# EAGLE design SmartPiezo (EAGLE 6.1)
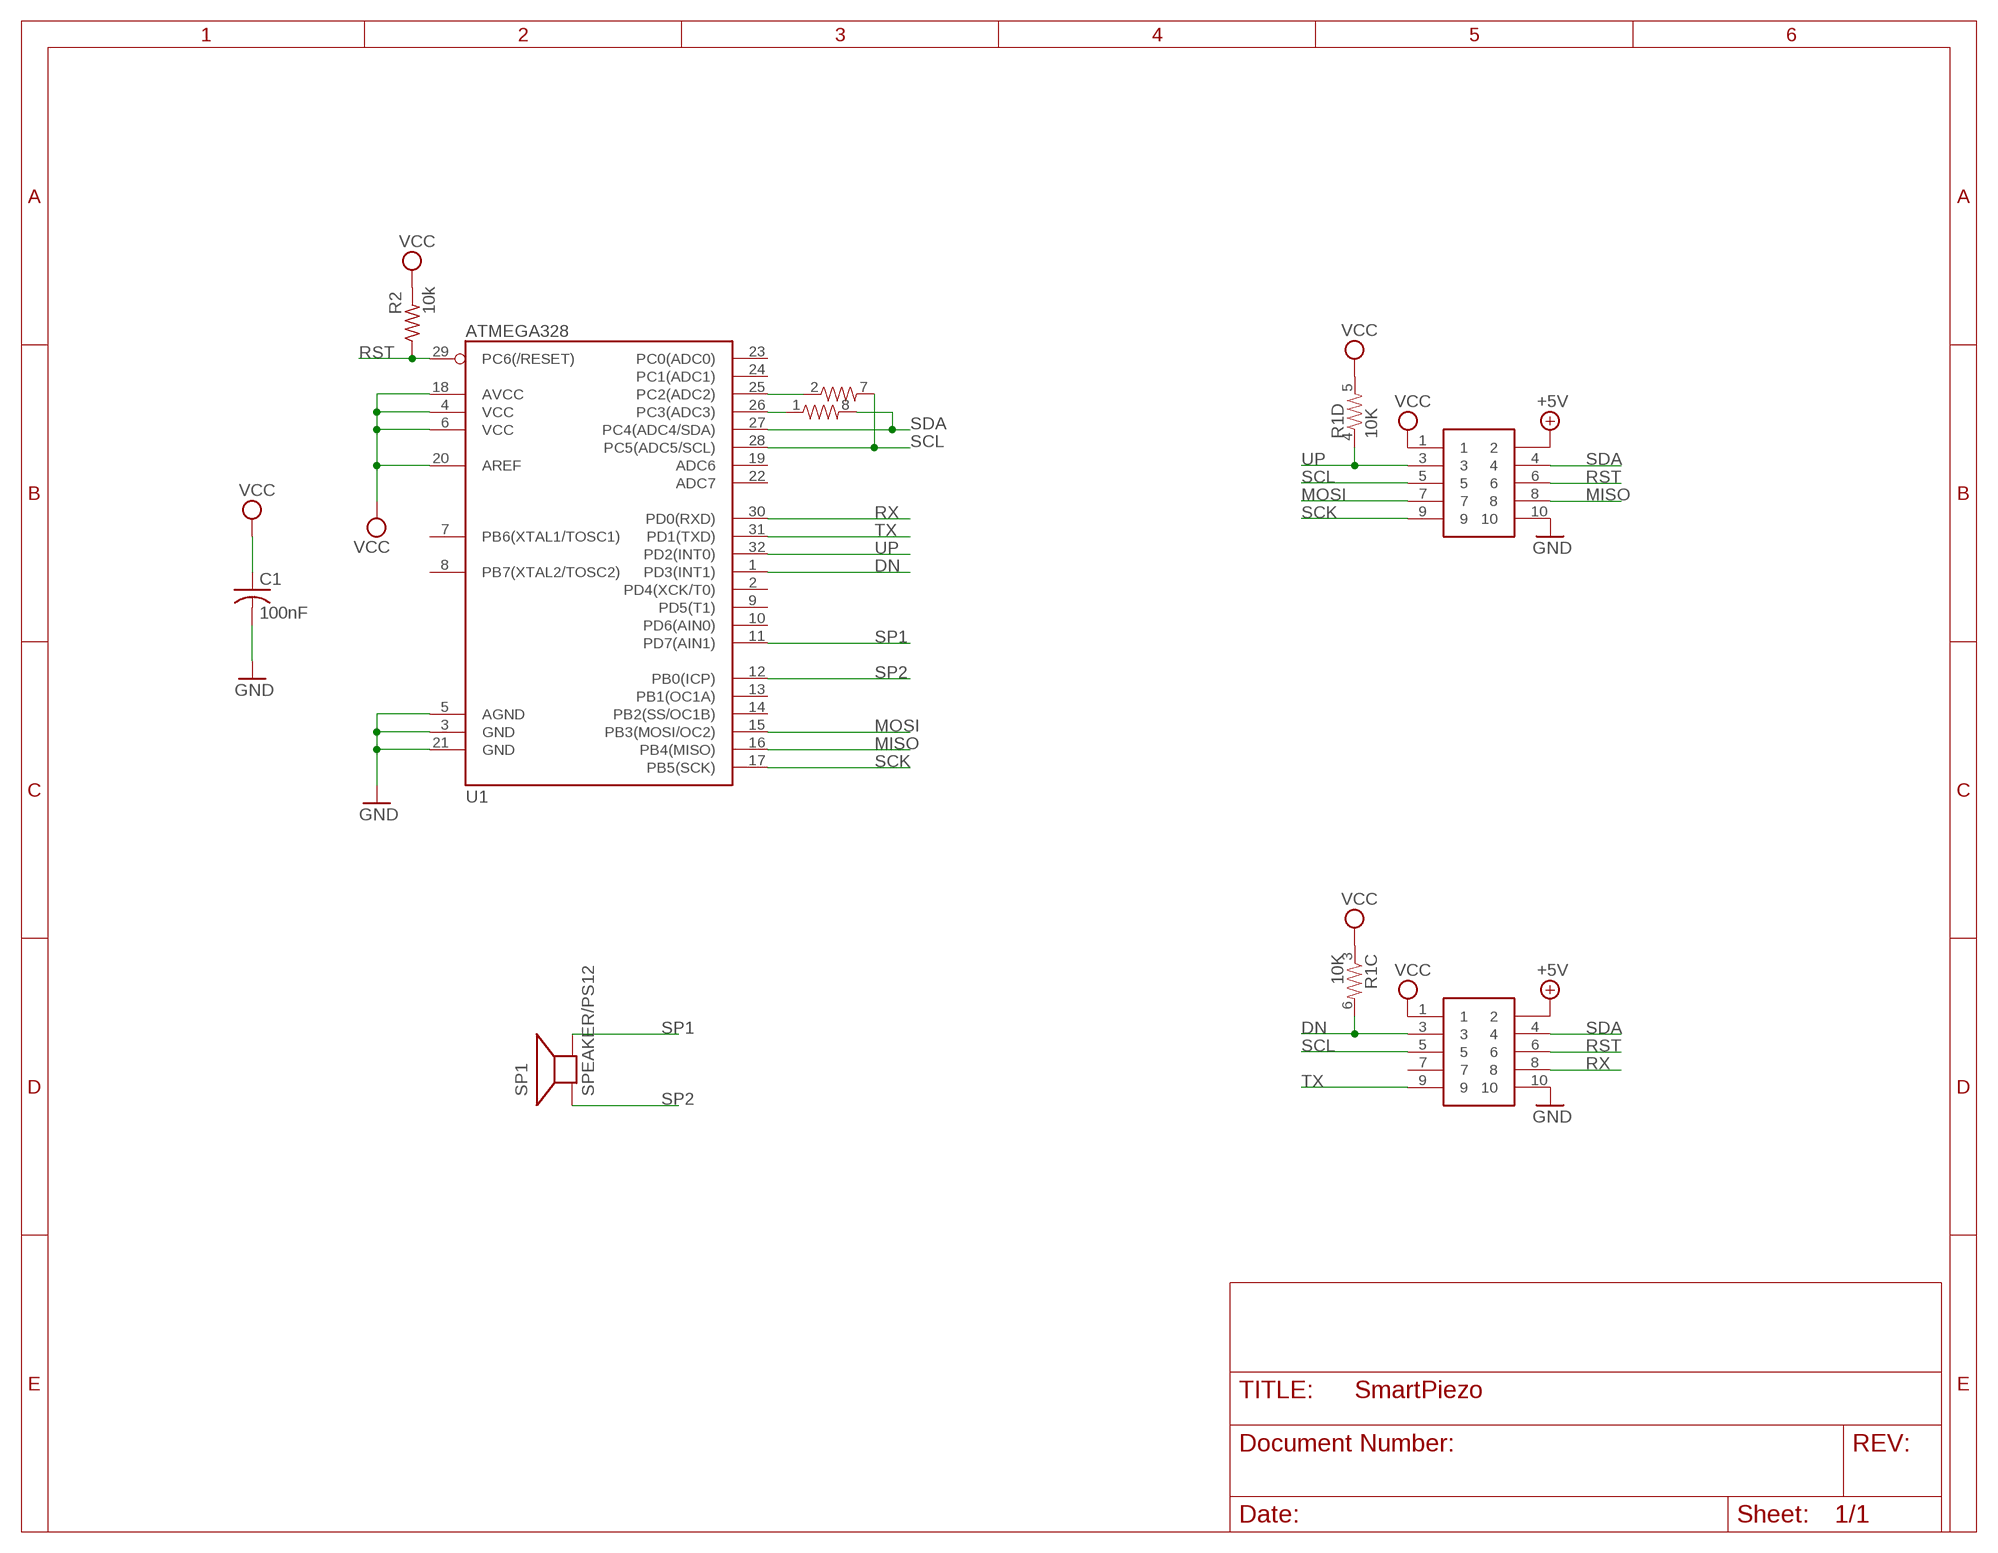
[diagram p0: schematic, sheet 1]

## Parts
*  SHF105SM  [SHF105DSM]
C1  100nF  C-USC0603K  [C0603K]
R1  10K  RESISTOR-ARRAY0603-ARV  [0603-ARV]
R2  10k  R-US_R0603  [R0603]
SP1  SPEAKER/PS12  [PS12]
U1  ATMEGA328  ATMEGA168  [TQFP32-08]
XY  SHF105SM  [SHF105DSM]

## Nets
+5V: *.2 XY.2
DN: *.3 R1.6 U1.1(PD3(INT1))
GND: *.10 C1.2 U1.3(GND) U1.5(AGND) U1.21(GND) XY.10
MISO: U1.16(PB4(MISO)) XY.8
MOSI: U1.15(PB3(MOSI/OC2)) XY.7
N$1: R1.2 U1.25(PC2(ADC2))
N$2: R1.1 U1.26(PC3(ADC3))
RST: *.6 R2.1 U1.29(PC6(/RESET)) XY.6
RX: *.8 U1.30(PD0(RXD))
SCK: U1.17(PB5(SCK)) XY.9
SCL: *.5 R1.7 U1.28(PC5(ADC5/SCL)) XY.5
SDA: *.4 R1.8 U1.27(PC4(ADC4/SDA)) XY.4
SP1: SP1.P$2(-) U1.11(PD7(AIN1))
SP2: SP1.P$1(+) U1.12(PB0(ICP))
TX: *.9 U1.31(PD1(TXD))
UP: R1.4 U1.32(PD2(INT0)) XY.3
VCC: *.1 C1.1 R1.3 R1.5 R2.2 U1.4(VCC) U1.6(VCC) U1.18(AVCC) U1.20(AREF) XY.1
Unconnected: *.7 U1.2(PD4(XCK/T0)) U1.7(PB6(XTAL1/TOSC1)) U1.8(PB7(XTAL2/TOSC2)) U1.9(PD5(T1)) U1.10(PD6(AIN0)) U1.13(PB1(OC1A)) U1.14(PB2(SS/OC1B)) U1.19(ADC6) U1.22(ADC7) U1.23(PC0(ADC0)) U1.24(PC1(ADC1))

## Notes on the sheet
- RST
- SDA
- SCL
- UP | SDA
- SCL | RST
- MOSI | MISO
- RX | SCK
- TX
- UP
- DN
- SP1
- SP2
- MOSI
- MISO
- SCK
- SP1 | DN | SDA
- SCL | RST
- RX
- TX
- SP2

## Library data of the parts
* XY = Gadgeteer:SHF105
C1 = rcl:C-US: CAPACITOR, American symbol
R1 = SparkFun:RESISTOR-ARRAY: Array Chip Resistor Source: RS Component / Phycomp
R2 = resistor:R-US_: RESISTOR, American symbol
SP1 = adafruit:SPEAKER: SPEAKER Source: Buerklin Added PS12 (for part # PS1240 piezo) http://www.ladyada.net/library/pcb/eaglelibrary.html
U1 = SparkFun:ATMEGA168

## Board
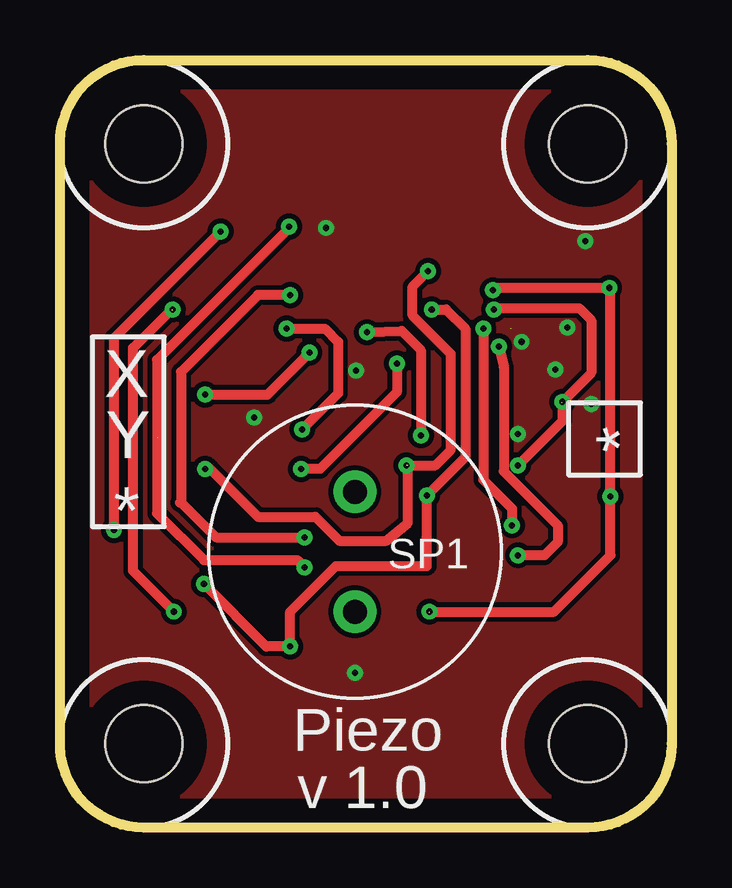
[diagram p1: board, top side]
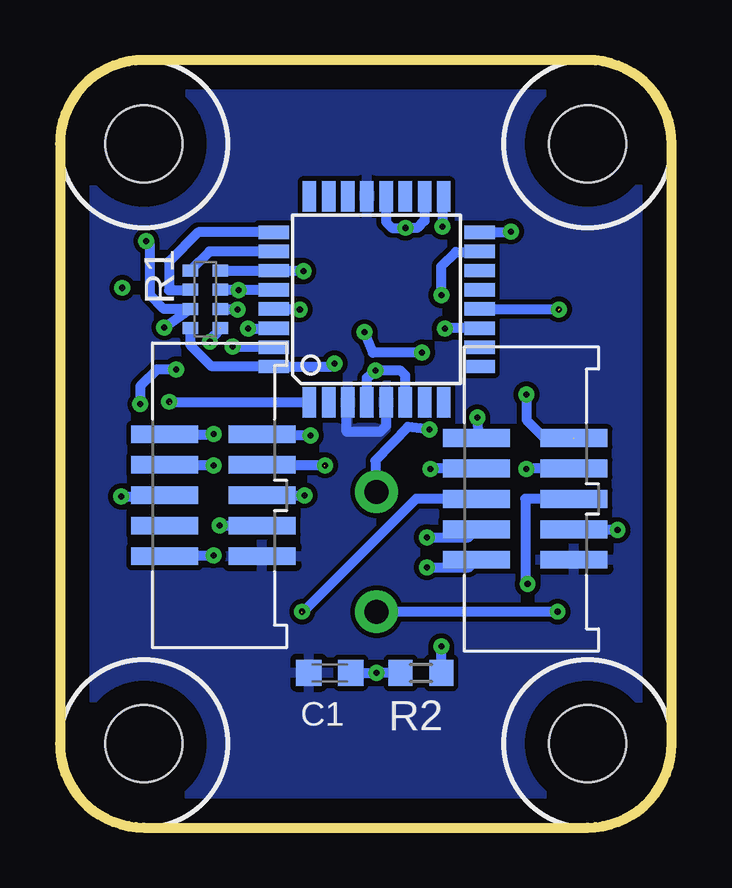
[diagram p2: board, bottom side, seen from below]

Size 25.5 x 32 mm. Coordinates in mm from the lower left corner, seen from the top.
Outline: 22,0 3.5,0 arc-90 0,3.5 0,28.5 arc-90 3.5,32 22,32 arc-90 25.5,28.5 25.5,3.5 arc-90 22,0
Copper layers (1*16): Top 0.035mm / dielectric 1.5mm / Bottom 0.035mm
Design rules: minimum track width 10mil, minimum drill 24mil, track to track 8mil, track to pad 8mil, pad to pad 8mil, via to via 8mil, smd to smd 8mil, copper to edge 40mil, drill to drill 8mil, minimum pad ring 10mil, minimum via ring 8mil, stop-mask expansion 4mil, vias tented up to drill 0mil, thermal gap 10mil

### Footprints (pad centres in the part's own frame; a part is rotated, then mirrored left to right if it is on the bottom)
SHF105DSM = smd 2.794 x 0.737: 1 -2.032,2.54; 2 2.032,2.54; 3 -2.032,1.27; 4 2.032,1.27; 5 -2.032,0; 6 2.032,0; 7 -2.032,-1.27; 8 2.032,-1.27; 9 -2.032,-2.54; 10 2.032,-2.54
C0603K = smd 1.05 x 1.08: 1 -0.875,0; 2 0.875,0
0603-ARV = smd 0.5 x 0.65: 1 -1.2,-0.625; 2 -0.4,-0.625; 3 0.4,-0.625; 4 1.2,-0.625; 5 1.2,0.625; 6 0.4,0.625; 7 -0.4,0.625; 8 -1.2,0.625
R0603 = smd 1 x 1.1: 1 -0.85,0; 2 0.85,0
PS12 = drill 1 pad 1.778: P$1 -2.5,0; P$2 2.5,0
TQFP32-08 = smd 1.27 x 0.559: 1 -4.293,2.8; 2 -4.293,2; 3 -4.293,1.2; 4 -4.293,0.4; 5 -4.293,-0.4; 6 -4.293,-1.2; 7 -4.293,-2; 8 -4.293,-2.8; 17 4.293,-2.8; 18 4.293,-2; 19 4.293,-1.2; 20 4.293,-0.4; 21 4.293,0.4; 22 4.293,1.2; 23 4.293,2; 24 4.293,2.8 | smd 0.559 x 1.27: 9 -2.8,-4.293; 10 -2,-4.293; 11 -1.2,-4.293; 12 -0.4,-4.293; 13 0.4,-4.293; 14 1.2,-4.293; 15 2,-4.293; 16 2.8,-4.293; 25 2.8,4.293; 26 2,4.293; 27 1.2,4.293; 28 0.4,4.293; 29 -0.4,4.293; 30 -1.2,4.293; 31 -2,4.293; 32 -2.8,4.293
HOLE3.2 = hole 3.2: 0,0

### Placement (x,y rotation side)
*  19.1,13.85 0 bottom
C1  14.25,6.45 180 bottom
R1  19.44,22.02 270 bottom
R2  10.45,6.45 180 bottom
SP1  12.3,11.5 90 top
U1  12.3,22.02 90 bottom
U$1  [HOLE3.2]  3.5,3.5 0 top
U$2  [HOLE3.2]  22,3.5 0 top
U$3  [HOLE3.2]  22,28.5 0 top
U$4  [HOLE3.2]  3.5,28.5 0 top
U$5  [LABEL_XYASTERISK]  0.85,12.45 0 top
U$6  [LABEL_ASTERISK]  24.2,14.7 90 top
XY  6.1,13.7 0 bottom

### Tracks (layer width: path | path; a pad name or v marks a point on that pad's centre or on a via)
+5V  (via drill 0.25)  (1 unrouted)
  Top 0.406: v6.05,18.05 8.65,18.05 v10.4,19.8 | v12.8,20.65 14.25,20.7 15.05,19.9 v15.05,16.35
  Bottom 0.406: v6.05,18.05 6.05,17 5.3,16.25 4.1,16.25 | v15.05,16.35 17.07,16.35 *.2 | v10.4,19.8 12.45,19.8 v12.8,20.65
DN  (via drill 0.25)  (1 unrouted)
  Top 0.406: v20.95,17.75 20.95,16.95 v19.1,15.1 | v18.1,21.6 18.15,21.65 21.65,21.65 22.15,21.15 22.15,18.95 20.9,17.7
  Bottom 0.406: R1.6 18.12,21.62 v18.1,21.6 | v19.1,15.1 21.11,15.1 *.3 | U1.1 20.93,17.73 v20.95,17.75
GND
  Bottom 0.406: U1.5 11.9,16.75 12.15,16.5 13.55,16.5 13.55,17.7
  pour Bottom: 0,32 0,0 25.5,0 25.5,32
MISO  (via drill 0.25)
  Top 0.406: v2.25,12.4 2.25,20.4 v6.7,24.85
  Bottom 0.406: XY.8 2.28,12.43 v2.25,12.4 | U1.16 6.73,24.82 v6.7,24.85
MOSI  (via drill 0.25)
  Top 0.406: v9.6,22.2 8.25,22.2 5.05,19 5.05,13.6 5,13.55 5.05,13.55 6.5,12.1 v10.2,12.1
  Bottom 0.406: v10.2,12.1 8.46,12.1 XY.7 | v9.6,22.2 9.6,23.4 9,24 8.03,24 U1.15
N$1
  Bottom 0.406: U1.25 19.73,24.82 20.95,23.6 20.95,22.4 20.09,22.4 R1.2
N$2
  Bottom 0.406: U1.26 19.27,24.02 R1.1
RST  (via drill 0.25)
  Top 0.406: v6,10.15 8.6,7.55 v9.6,7.55 9.6,9 11.5,10.9 15.3,10.9 v15.3,13.85 16.9,15.45 16.9,20.8 16.1,21.6 v15.5,21.6
  Bottom 0.406: R2.1 v9.6,7.55 | *.6 v15.3,13.85 15.2,13.85 | XY.6 6.1,13.7 6.1,10.25 v6,10.15 | U1.29 15.52,21.62 v15.5,21.6
RX  (via drill 0.25)
  Top 0.406: v17.65,20.8 17.65,14.5 18.85,13.3 v18.85,12.6
  Bottom 0.406: v17.65,20.8 16.61,20.8 U1.30 | v18.85,12.6 17.09,12.6 *.8
SCK  (via drill 0.25)
  Top 0.406: v9.55,25.05 9.55,25 4.05,19.5 4.05,13.1 6,11.15 9.9,11.15 v10.2,10.85
  Bottom 0.406: v10.2,10.85 8.44,10.85 XY.9 | U1.17 9.55,26.26 v9.55,25.05
SCL  (via drill 0.25)  (1 unrouted)
  Top 0.406: v18.05,22.4 18.15,22.5 v22.9,22.5 22.95,22.45 v22.95,13.8 22.95,11.35 20.6,9 v15.4,9
  Bottom 0.406: U1.28 R1.7 18.07,22.42 v18.05,22.4 | v22.95,13.8 21.18,13.8 *.5 | XY.5 10.65,13.7 15.4,8.95
SDA  (via drill 0.25)  (1 unrouted)
  Top 0.406: v6.05,14.95 6.25,14.95 8.25,12.95 10.65,12.95 11.65,11.95 13.6,11.95 14.5,12.7 14.5,15.1 | v14.45,15.1 15.65,15.1 16.3,15.75 16.3,19.75 14.7,21.35 14.7,22.55 v15.35,23.2
  Bottom 0.406: R1.8 U1.27 | U1.27 | v14.45,15.1 17.05,15.1 *.4 | U1.27 15.37,23.22 v15.35,23.2 | XY.4 6.03,14.97 v6.05,14.95
SP1  (via drill 0.25)
  Top 0.406: v9.45,20.8 11.05,20.8 11.6,20.25 11.6,18.1 v10.1,16.6
  Bottom 0.406: v10.1,16.6 11,16.7 12.35,15.3 12.35,14.05 SP1.P$2 | U1.11 9.43,20.82 v9.45,20.8
SP2  (via drill 0.25)  (2 unrouted)
  Top 0.406: v4.75,9 3.05,10.7 3.05,20 4.65,21.6 4.75,21.6
  Bottom 0.406: v4.75,9 SP1.P$1 | U1.12 4.77,21.62 4.7,21.55
  other vias: 4.7,21.6
TX  (via drill 0.25)
  Top 0.406: v18.3,20.05 18.5,19.2 18.5,14.85 20.75,12.6 20.75,11.9 20.2,11.35 v19.1,11.35
  Bottom 0.406: v18.3,20.05 16.62,20.05 U1.31 | *.9 21.09,11.35 v19.1,11.35
UP  (via drill 0.25)
  Top 0.406: v14.05,19.35 14.05,18.15 10.85,14.95 v10.05,14.95
  Bottom 0.406: R1.4 20.07,20.12 19.2,19.25 16.62,19.25 U1.32 14.18,19.22 v14.05,19.35 | XY.3 10.03,14.97 v10.05,14.95
VCC  (via drill 0.25)  (1 unrouted)
  Bottom 0.406: R2.2 v12.3,6.45 C1.1 | v8.1,17.1 8.07,16.3 XY.1 | *.1 v19.11,16.39 v19.1,16.4 | U1.4 12.7,18.75 12.4,19.05 v12.35,19.05 11.3,19.05 11.1,18.85 U1.6 | U1.18 10.3,25.3 10.6,25 v11.1,25 11.65,25 11.9,25.25 U1.20 | v21.15,20.85 20.1,21.6 | v19.25,20.25 19.1,20.5 18.8,20.8 | v20.65,19.1 21.45,19.1 22.15,18.4 v22.15,17.65 | R1.3 21.17,21.62 21.75,22.2 21.75,24.3 v21.9,24.45
  pour Top: 0,32 0,0 25.5,0 25.5,32

### Text on the board
tNames: Piezo | v 1.0